# Altium project Dionysus_PCB.PrjPcb (part 2 of 2)

## Sheet Dionysus_FTDI_Comm.SchDoc: USB Communication
size B; CompanyName: Cospan Design; DrawnBy: David McCoy; Engineer: David McCoy; DocumentNumber: 8; SheetNumber: 8; SheetTotal: 8
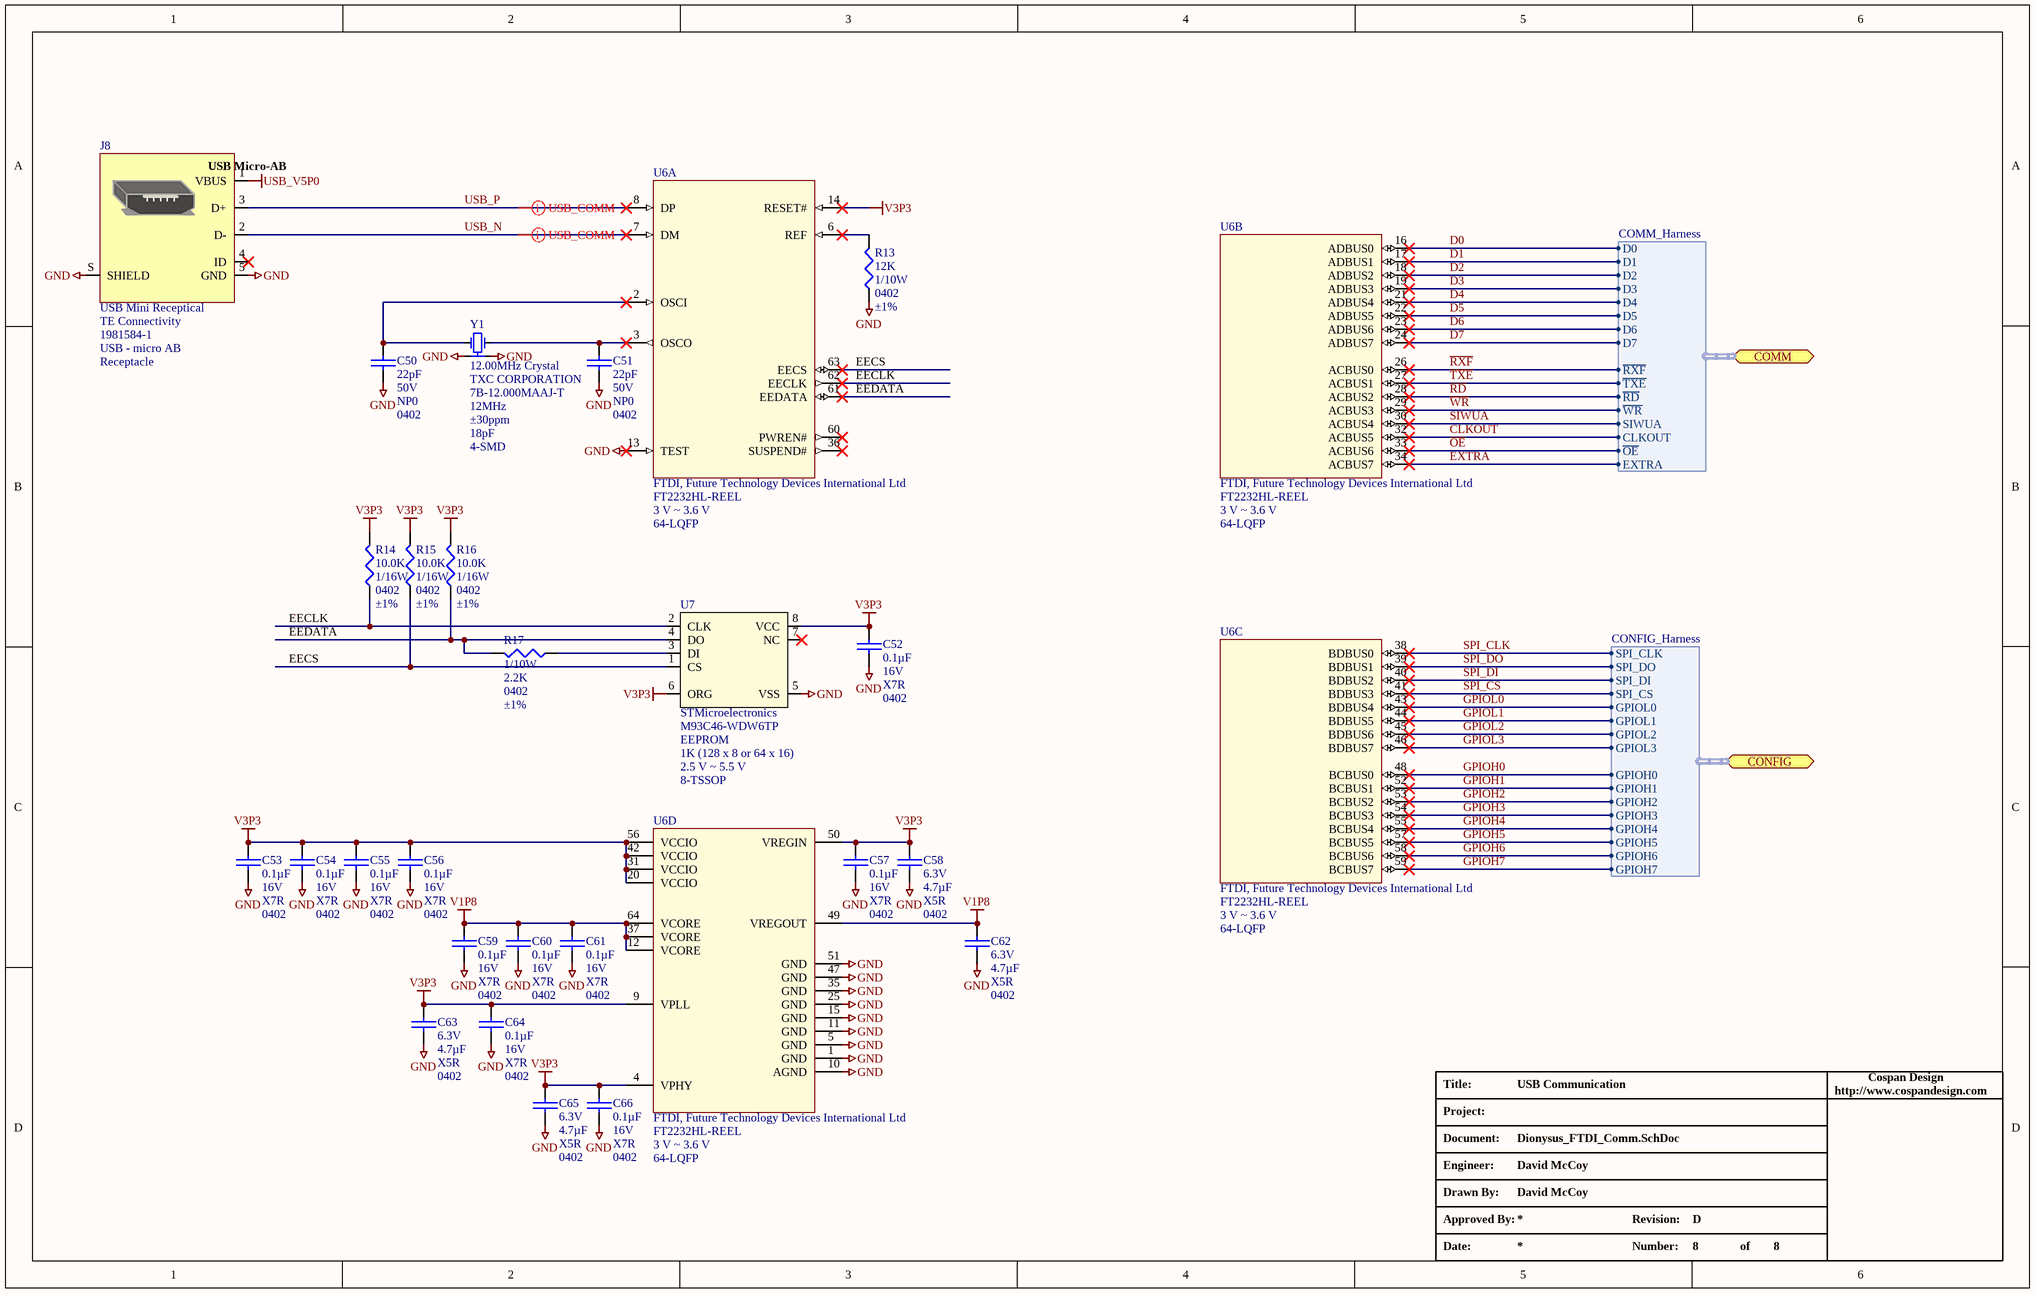
[diagram p4: Dionysus_FTDI_Comm.SchDoc]

### Parts
C50  Voltage - Rated: 50V  Temperature Coefficient: NP0  Package / Case: 0402  [C_ERA-0402]  (hidden comment: 22pF)
C51  Voltage - Rated: 50V  Temperature Coefficient: NP0  Package / Case: 0402  [C_ERA-0402]  (hidden comment: 22pF)
C52  Capacitance: 0.1µF  Voltage - Rated: 16V  Temperature Coefficient: X7R  Package / Case: 0402  [C_ERA-0402]  (hidden comment: 0.1uF)
C53  Capacitance: 0.1µF  Voltage - Rated: 16V  Temperature Coefficient: X7R  Package / Case: 0402  [C_ERA-0402]  (hidden comment: 0.1uF)
C54  Capacitance: 0.1µF  Voltage - Rated: 16V  Temperature Coefficient: X7R  Package / Case: 0402  [C_ERA-0402]  (hidden comment: 0.1uF)
C55  Capacitance: 0.1µF  Voltage - Rated: 16V  Temperature Coefficient: X7R  Package / Case: 0402  [C_ERA-0402]  (hidden comment: 0.1uF)
C56  Capacitance: 0.1µF  Voltage - Rated: 16V  Temperature Coefficient: X7R  Package / Case: 0402  [C_ERA-0402]  (hidden comment: 0.1uF)
C57  Capacitance: 0.1µF  Voltage - Rated: 16V  Temperature Coefficient: X7R  Package / Case: 0402  [C_ERA-0402]  (hidden comment: 0.1uF)
C58  Voltage - Rated: 6.3V  Capacitance: 4.7µF  Temperature Coefficient: X5R  Package / Case: 0402  [C_ERA-0402]  (hidden comment: 4.7uF)
C59  Capacitance: 0.1µF  Voltage - Rated: 16V  Temperature Coefficient: X7R  Package / Case: 0402  [C_ERA-0402]  (hidden comment: 0.1uF)
C60  Capacitance: 0.1µF  Voltage - Rated: 16V  Temperature Coefficient: X7R  Package / Case: 0402  [C_ERA-0402]  (hidden comment: 0.1uF)
C61  Capacitance: 0.1µF  Voltage - Rated: 16V  Temperature Coefficient: X7R  Package / Case: 0402  [C_ERA-0402]  (hidden comment: 0.1uF)
C62  Voltage - Rated: 6.3V  Capacitance: 4.7µF  Temperature Coefficient: X5R  Package / Case: 0402  [C_ERA-0402]  (hidden comment: 4.7uF)
C63  Voltage - Rated: 6.3V  Capacitance: 4.7µF  Temperature Coefficient: X5R  Package / Case: 0402  [C_ERA-0402]  (hidden comment: 4.7uF)
C64  Capacitance: 0.1µF  Voltage - Rated: 16V  Temperature Coefficient: X7R  Package / Case: 0402  [C_ERA-0402]  (hidden comment: 0.1uF)
C65  Voltage - Rated: 6.3V  Capacitance: 4.7µF  Temperature Coefficient: X5R  Package / Case: 0402  [C_ERA-0402]  (hidden comment: 4.7uF)
C66  Capacitance: 0.1µF  Voltage - Rated: 16V  Temperature Coefficient: X7R  Package / Case: 0402  [C_ERA-0402]  (hidden comment: 0.1uF)
J8  USB Mini Receptical  Manufacturer: TE Connectivity  Manufacturer Part Number: 1981584-1  Connector Type: USB - micro AB  Gender: Receptacle  [MICRO_USB_RECEPTICAL]
R13  Resistance (Ohms): 12K  Power (Watts): 1/10W  Case: 0402  Tolerance: ±1%  [ERA-0402]  (hidden comment: R_0402_12.0K)
R14  Resistance In Ohms: 10.0K  Power (Watts): 1/16W  Case: 0402  Tolerance: ±1%  [ERA-0402]  (hidden comment: R_0402_10.0K)
R15  Resistance In Ohms: 10.0K  Power (Watts): 1/16W  Case: 0402  Tolerance: ±1%  [ERA-0402]  (hidden comment: R_0402_10.0K)
R16  Resistance In Ohms: 10.0K  Power (Watts): 1/16W  Case: 0402  Tolerance: ±1%  [ERA-0402]  (hidden comment: R_0402_10.0K)
R17  Power (Watts): 1/10W  Resistance In Ohms: 2.2K  Case: 0402  Tolerance: ±1%  [ERA-0402]  (hidden comment: 2.2k Ohms)
U6  Manufacturer: FTDI, Future Technology Devices International Ltd  Manufacturer Part Number: FT2232HL-REEL  Voltage - Supply: 3 V ~ 3.6 V  Package / Case: 64-LQFP  [LQFP-64_N]  (hidden comment: U_FT2232H-LQFP64)  (parts A,B,C,D of 4)
U7  Manufacturer: STMicroelectronics  Manufacturer Part Number: M93C46-WDW6TP  Memory Size: 1K (128 x 8 or 64 x 16)  Voltage - Supply: 2.5 V ~ 5.5 V  Package / Case: 8-TSSOP  [TSOP65P640X120-8L]  (hidden comment: EEPROM)
Y1  12.00MHz Crystal  Manufacturer: TXC CORPORATION  Manufacturer Part Number: 7B-12.000MAAJ-T  Frequency: 12MHz  Frequency Tolerance: ±30ppm  Load Capacitance: 18pF  Package / Case: 4-SMD  [LCCS220P500X320X105-4L]

### Ports
COMM (harness COMM_Harness), CONFIG (harness CONFIG_Harness)

### Harnesses
COMM_Harness: D0, D1, D2, D3, D4, D5, D6, D7, ~{RXF}, ~{TXE}, ~{RD}, ~{WR}, SIWUA, CLKOUT, ~{OE}, EXTRA
CONFIG_Harness: SPI_CLK, SPI_DO, SPI_DI, SPI_CS, GPIOL0, GPIOL1, GPIOL2, GPIOL3, GPIOH0, GPIOH1, GPIOH2, GPIOH3, GPIOH4, GPIOH5, GPIOH6, GPIOH7

### Nets
GND: C50.1 C51.1 C52.1 C53.1 C54.1 C55.1 C56.1 C57.1 C58.1 C59.1 C60.1 C61.1 C62.1 C63.1 C64.1 C65.1 C66.1 J8.5(GND) J8.S(SHIELD) R13.2 U6.1(GND) U6.5(GND) U6.10(AGND) U6.11(GND) U6.13(TEST) U6.15(GND) U6.25(GND) U6.35(GND) U6.47(GND) U6.51(GND) U7.5(VSS) Y1.2 Y1.4
USB_V5P0: J8.1(VBUS)
V1P8: C59.2 C60.2 C61.2 C62.2 U6.12(VCORE) U6.37(VCORE) U6.49(VREGOUT) U6.64(VCORE)
V3P3: C52.2 C53.2 C54.2 C55.2 C56.2 C57.2 C58.2 C63.2 C64.2 C65.2 C66.2 R14.1 R15.1 R16.1 U6.4(VPHY) U6.9(VPLL) U6.14(RESET#) U6.20(VCCIO) U6.31(VCCIO) U6.42(VCCIO) U6.50(VREGIN) U6.56(VCCIO) U7.6(ORG) U7.8(VCC)
CLKOUT: U6.32(ACBUS5) ; port COMM.CLKOUT
D0: U6.16(ADBUS0) ; port COMM.D0
D1: U6.17(ADBUS1) ; port COMM.D1
D2: U6.18(ADBUS2) ; port COMM.D2
D3: U6.19(ADBUS3) ; port COMM.D3
D4: U6.21(ADBUS4) ; port COMM.D4
D5: U6.22(ADBUS5) ; port COMM.D5
D6: U6.23(ADBUS6) ; port COMM.D6
D7: U6.24(ADBUS7) ; port COMM.D7
EECLK: R14.2 U6.62(EECLK) U7.2(CLK)
EECS: R15.2 U6.63(EECS) U7.1(CS)
EEDATA: R16.2 R17.1 U6.61(EEDATA) U7.4(DO)
EXTRA: U6.34(ACBUS7) ; port COMM.EXTRA
GPIOH0: U6.48(BCBUS0) ; port CONFIG.GPIOH0
GPIOH1: U6.52(BCBUS1) ; port CONFIG.GPIOH1
GPIOH2: U6.53(BCBUS2) ; port CONFIG.GPIOH2
GPIOH3: U6.54(BCBUS3) ; port CONFIG.GPIOH3
GPIOH4: U6.55(BCBUS4) ; port CONFIG.GPIOH4
GPIOH5: U6.57(BCBUS5) ; port CONFIG.GPIOH5
GPIOH6: U6.58(BCBUS6) ; port CONFIG.GPIOH6
GPIOH7: U6.59(BCBUS7) ; port CONFIG.GPIOH7
GPIOL0: U6.43(BDBUS4) ; port CONFIG.GPIOL0  [project net FPGA_PROGRAM]
GPIOL1: U6.44(BDBUS5) ; port CONFIG.GPIOL1
GPIOL2: U6.45(BDBUS6) ; port CONFIG.GPIOL2
GPIOL3: U6.46(BDBUS7) ; port CONFIG.GPIOL3
~{OE}: U6.33(ACBUS6) ; port COMM.~{OE}
~{RD}: U6.28(ACBUS2) ; port COMM.~{RD}
~{RXF}: U6.26(ACBUS0) ; port COMM.~{RXF}
SIWUA: U6.30(ACBUS4) ; port COMM.SIWUA
SPI_CLK: U6.38(BDBUS0) ; port CONFIG.SPI_CLK
SPI_CS: U6.41(BDBUS3) ; port CONFIG.SPI_CS
SPI_DI: U6.40(BDBUS2) ; port CONFIG.SPI_DI
SPI_DO: U6.39(BDBUS1) ; port CONFIG.SPI_DO
~{TXE}: U6.27(ACBUS1) ; port COMM.~{TXE}
USB_N: J8.2(D-) U6.7(DM)
USB_P: J8.3(D+) U6.8(DP)
~{WR}: U6.29(ACBUS3) ; port COMM.~{WR}
NetC50_2: C50.2 U6.2(OSCI) Y1.1
NetC51_2: C51.2 U6.3(OSCO) Y1.3
NetR13_1: R13.1 U6.6(REF)
NetR17_2: R17.2 U7.3(DI)

Not connected (* = marked no-connect by the designer): J8 4(ID)*; U6 36(SUSPEND#)* 60(PWREN#)*; U7 7(NC)*

### Layout directives
differential pair: USB_N, USB_P

### Notes on the sheet
- Title:
- http://www.cospandesign.com
- Cospan Design
- Project:
- Document:
- Engineer:
- Drawn By:
- Approved By:
- Revision:
- Date:
- Number:
- of
- (in symbol J_USB_MICRO_AB) USB Micro-AB

### Library data of the parts
C50 C51 = C_0402_22PF_50V: CAP CER 22PF 50V NP0 0402; Manufacturer: TDK Corporation; Manufacturer Part Number: C1005C0G1H220F; Description: CAP CER 22PF 50V 1% NP0 0402; Tolerance: ±1%; Supplier 1: Digi-Key; Supplier Part Number 1: 445-5360-1-ND; RoHS: RoHS Compliant; Category: Capacitors; Stock 1: 16726; Pricing: 1=0.44, 10=0.385, 100=0.1925, 250=0.154, 500=0.14026, 1000=0.1265, 5000=0.1045 (USD); Mounting Type: Surface Mount, MLCC; Operating Temperature: -55°C ~ 125°C; Features: -; Applications: General Purpose; Ratings: -; Size / Dimension: 0.039" L x 0.020" W (1.00mm x 0.50mm); Lead Spacing: -; Packaging: Cut Tape (CT); Lead Style: -; ComponentLink1URL: http://www.tdk.com/pdf/tight_tol_B11.pdf; ComponentLink1Description: http://www.tdk.com/pdf/tight_tol_B11.pdf; Capacitance: 22pF; Height - Seated (Max): -; Thickness (Max): 0.022" (0.55mm)
C52-C57 C59-C61 C64 C66 = C_0402_0.1UF_16V: CAP CER .10UF 16V X7R 0402; Manufacturer: TDK Corporation; Manufacturer Part Number: C1005X7R1C104K; Tolerance: ±10%; Supplier 1: Digi-Key; Supplier Part Number 1: 445-4952-1-ND; RoHS: RoHS Compliant; Category: Capacitors; Stock 1: 230800; Pricing: 10=0.024, 100=0.0143, 500=0.00826, 1000=0.00572 (USD); Mounting Type: Surface Mount, MLCC; Features: General Purpose; Lead Spacing: -; Thickness: 0.50mm; Packaging: Cut Tape (CT); ComponentLink1URL: http://www.tdk.co.jp/tefe02/e412_c.pdf; ComponentLink1Description: http://www.tdk.co.jp/tefe02/e412_c.pdf; Operating Temperature: -55°C ~ 125°C
C58 C62 C63 C65 = C_0402_4.7UF: CAP CER 4.7UF 6.3V X5R 0402; Manufacturer: Murata Electronics North America; Manufacturer Part Number: GRM155R60J475ME87D; Tolerance: ±20%; Supplier 1: Digi-Key; Supplier Part Number 1: 445-7395-1-ND; RoHS: RoHS Compliant; Category: Capacitors; Stock 1: 1176918; Pricing: 1=0.46, 10=0.365, 50=0.264, 100=0.22, 250=0.165, 500=0.1408, 1000=0.11, 5000=0.0836 (USD); Mounting Type: Surface Mount, MLCC; Operating Temperature: -55°C ~ 85°C; Applications: General Purpose; Ratings: -; Size / Dimension: 0.039" L x 0.020" W (1.00mm x 0.50mm); Height: -; Thickness: 0.022" (0.55mm); Lead Spacing: -; Features: -; Packaging: Cut Tape (CT); Lead Style: -; ComponentLink1URL: http://www.murata.com/products/catalog/pdf/c02e.pdf; ComponentLink1Description: http://www.murata.com/products/catalog/pdf/c02e.pdf; Stock 2: 8098; Pricing 2: 1=0.32, 10=0.28, 100=0.14, 250=0.112, 500=0.102, 1000=0.092, 5000=0.076 (USD); Height - Seated (Max): -; Thickness (Max): 0.026" (0.65mm); ComponentLink2URL: http://www.tdk.com/pdf/general_B11.pdf; ComponentLink2Description: http://www.tdk.com/pdf/general_B11.pdf
J8 = J_USB_MICRO_AB: CONN RCPT MICRO USB TYPE AB; Number of Contacts: 5; Specifications: USB 1.0; Supplier 1: Digi-Key; Supplier Part Number 1: A97799CT-ND; RoHS: RoHS Compliant; Category: Connectors, Interconnects; Stock 1: 8650; Pricing: 1=1.23, 10=1.082, 25=1.0184, 50=0.9758, 100=0.9334, 250=0.84856, 500=0.76368 (USD); Mounting Type: Surface Mount, Right Angle, Horizontal; Features: -; Packaging: Cut Tape (CT); Ingress Protection: -; ComponentLink1URL: http://documents.tycoelectronics.com/commerce/DocumentDelivery/DDEController?Action=srchrtrv&DocNm=1981584&DocType=CD&DocLang=EN; ComponentLink1Description: http://documents.tycoelectronics.com/commerce/DocumentDelivery/DDEController?Action=srchrtrv&DocNm=1981584&DocType=CD&DocLang=EN
R13 = R_0402_12.0K: RES 12.0K OHM 1/16W 1% 0402 SMD; Manufacturer: Panasonic - ECG; Manufacturer Part Number: ERJ-2RKF1202X; Description: RES 12.0K OHM 1/10W 1% 0402 SMD; Temperature Coefficient: ±100ppm/°C; Supplier 1: Digi-Key; Supplier Part Number 1: P12.0KLDKR-ND; RoHS: RoHS Compliant; Category: Resistors; Stock 1: 282752; Pricing: 1=0.06, 50=0.0242, 100=0.0184, 250=0.01364, 500=0.01008, 1000=0.00672, 5000=0.00473 (USD); Composition: Thick Film; Features: -; Size / Dimension: 0.039" L x 0.020" W (1.00mm x 0.50mm); Height: 0.014" (0.35mm); Number of Terminations: 2; Packaging: Digi-Reel®; Package / Case: 0402 (1005 Metric); ComponentLink1URL: http://industrial.panasonic.com/www-cgi/jvcr13pz.cgi?E+PZ+3+AOA0002+ERJ2RKF1202X+7+WW; ComponentLink1Description: http://industrial.panasonic.com/www-cgi/jvcr13pz.cgi?E+PZ+3+AOA0002+ERJ2RKF1202X+7+WW
R14-R16 = R_0402_10.0K: RES 10.0K OHM 1/16W 1% 0402 SMD; Manufacturer: Stackpole Electronics Inc; Manufacturer Part Number: RMCF0402FT10K0; Description: RES 10K OHM 1/16W 1% 0402 SMD; Temperature Coefficient: ±100ppm/°C; Resistance (Ohms): 10k; Supplier 1: Digi-Key; Supplier Part Number 1: RMCF0402FT10K0CT-ND; RoHS: RoHS Compliant; Category: Resistors; Stock 1: 234525; Pricing: 1=0.04, 10=0.025, 50=0.0138, 100=0.0105, 250=0.0078, 500=0.00576, 1000=0.00384, 2500=0.00324, 5000=0.0027 (USD); Composition: Thick Film; Features: -; Packaging: Cut Tape (CT); ComponentLink1URL: http://www.seielect.com/Catalog/SEI-RMCF_RMCP.pdf; ComponentLink1Description: http://www.seielect.com/Catalog/SEI-RMCF_RMCP.pdf; Package / Case: 0402 (1005 Metric); Size / Dimension: 0.039" L x 0.020" W (1.00mm x 0.50mm); Height: 0.016" (0.40mm); Number of Terminations: 2
R17 = R_0402_2.2K: RES 2.20K OHM 1/10W 1% 0402 SMD; Manufacturer: Yageo; Manufacturer Part Number: RC0402FR-072K2L; Description: RES 2.20K OHM 1/16W 1% 0402 SMD; Temperature Coefficient: ±100ppm/°C; Supplier 1: Digi-Key; Supplier Part Number 1: 311-2.20KLRCT-ND; RoHS: RoHS Compliant; Category: Resistors; Stock 1: 0; Pricing: 10=0.014, 100=0.0063, 500=0.00382, 1000=0.0027, 5000=0.00203 (USD); Resistance (Ohms): 2.2K; Composition: Thick Film; Features: -; Size / Dimension: 0.039" L x 0.020" W (1.00mm x 0.50mm); Height: 0.016" (0.40mm); Packaging: Cut Tape (CT); Package / Case: 0402 (1005 Metric); ComponentLink1URL: http://www.yageo.com/documents/recent/PYu-RC0402_51_RoHS_L_6.pdf; ComponentLink1Description: http://www.yageo.com/documents/recent/PYu-RC0402_51_RoHS_L_6.pdf; Number of Terminations: 2
U6 = U_FT2232H-LQFP64: IC USB HS DUAL UART/FIFO 64-LQFP; Number of Channels: 2, DUART; FIFO's: 4096 Byte; Protocol: RS-232, RS-422, RS-485; With Parallel Port: Yes; Supplier 1: Digi-Key; RoHS: RoHS Compliant; Category: Integrated Circuits (ICs); Stock 1: 18803; Pricing 1: 1=6.71, 10=6.2, 50=5.77, 100=5.4, 250=4.56, 500=4.06 (USD); Features: USB to UART and/or FIFO, SPI, I2C, JTAG; With Auto Flow Control: Yes; With IrDA Encoder/Decoder: -; With False Start Bit Detection: -; With Modem Control: Yes; With CMOS: Yes; Mounting Type: Surface Mount; Supplier Device Package: 64-LQFP; Packaging: Cut Tape (CT); ComponentLink1URL: http://www.ftdichip.com/Support/Documents/DataSheets/ICs/DS_FT2232H.pdf; ComponentLink1Description: http://www.ftdichip.com/Support/Documents/DataSheets/ICs/DS_FT2232H.pdf; Supplier Part Number 1: 768-1024-1-ND
U7 = U_EEPROM_M93C46-WDW6TP: IC EEPROM 1KBIT 2MHZ 8TSSO; Description: IC EEPROM 1KBIT 2MHZ 8TSSOP; Format - Memory: EEPROMs - Serial; Interface: Microwire, 3-Wire Serial; Supplier 1: Digi-Key; RoHS: RoHS Compliant; Category: Integrated Circuits (ICs); Stock 1: 16982; Pricing 1: 1=0.64, 10=0.51, 100=0.3828, 250=0.3306, 500=0.2842, 1000=0.2204 (USD); Speed: 2MHz; Operating Temperature: -40°C ~ 85°C; Supplier Device Package: 8-TSSOP; Packaging: Cut Tape (CT); ComponentLink1URL: http://www.st.com/internet/com/TECHNICAL_RESOURCES/TECHNICAL_LITERATURE/DATASHEET/CD00001142.pdf; ComponentLink1Description: http://www.st.com/internet/com/TECHNICAL_RESOURCES/TECHNICAL_LITERATURE/DATASHEET/CD00001142.pdf; Supplier Part Number 1: 497-8655-1-ND; Memory Type: EEPROM
Y1 = Y_SMD_12.00MHZ_18PF: CRYSTAL 12.000 MHZ 18PF SMD; Operating Mode: Fundamental; Supplier 1: Digi-Key; RoHS: RoHS Compliant; Category: Crystals and Oscillators; Stock 1: 13709; Pricing 1: 1=1.13, 10=0.975, 50=0.855, 100=0.675, 500=0.57 (USD); Type: MHz Crystal; Frequency Stability: ±30ppm; Operating Temperature: -20°C ~ 70°C; Mounting Type: Surface Mount; Size / Dimension: 0.197" L x 0.126" W (5.00mm x 3.20mm); Height: 0.041" (1.05mm); Packaging: Cut Tape (CT); ComponentLink1URL: http://www.txccrystal.com/images/pdf/7b.pdf; ComponentLink1Description: http://www.txccrystal.com/images/pdf/7b.pdf; Supplier Part Number 1: 887-1099-1-ND

## Nets that join several sheets
GND: Dionysus_FPGA (53 pins), Dionysus_SDRAM (16 pins), Dionysus_Buttons_LEDs (10 pins), Dionysus_FTDI_Comm (33 pins)
V3P3: Dionysus_FPGA (49 pins), Dionysus_SDRAM (16 pins), Dionysus_Buttons_LEDs (BUTTON_0.3 BUTTON_0.4 BUTTON_1.3 BUTTON_1.4), Dionysus_FTDI_Comm (24 pins)
A0: Dionysus_FPGA (U1.35), Dionysus_SDRAM (U5.23)
A1: Dionysus_FPGA (U1.23), Dionysus_SDRAM (U5.24)
A2: Dionysus_FPGA (U1.22), Dionysus_SDRAM (U5.25)
A3: Dionysus_FPGA (U1.21), Dionysus_SDRAM (U5.26)
A4: Dionysus_FPGA (U1.14), Dionysus_SDRAM (U5.29)
A5: Dionysus_FPGA (U1.15), Dionysus_SDRAM (U5.30)
A6: Dionysus_FPGA (U1.26), Dionysus_SDRAM (U5.31)
A7: Dionysus_FPGA (U1.27), Dionysus_SDRAM (U5.32)
A8: Dionysus_FPGA (U1.29), Dionysus_SDRAM (U5.33)
A9: Dionysus_FPGA (U1.33), Dionysus_SDRAM (U5.34)
A10: Dionysus_FPGA (U1.24), Dionysus_SDRAM (U5.22)
A11: Dionysus_FPGA (U1.30), Dionysus_SDRAM (U5.35)
BA0: Dionysus_FPGA (U1.32), Dionysus_SDRAM (U5.20)
BA1: Dionysus_FPGA (U1.34), Dionysus_SDRAM (U5.21)
BUTTON0: Dionysus_FPGA (U1.60), Dionysus_Buttons_LEDs (BUTTON_1.1 C1.2 R3.2)
BUTTON1: Dionysus_FPGA (U1.138), Dionysus_Buttons_LEDs (BUTTON_0.1)
~{CAS}: Dionysus_FPGA (U1.45), Dionysus_SDRAM (U5.17)
~{CS}: Dionysus_FPGA (R8.2 U1.39), Dionysus_SDRAM (U5.19)
CKE: Dionysus_FPGA (U1.40), Dionysus_SDRAM (U5.37)
CLK: Dionysus_FPGA (U1.57), Dionysus_SDRAM (R11.2)
CLKOUT: Dionysus_FPGA (U1.123), Dionysus_FTDI_Comm (U6.32)
D0: Dionysus_FPGA (U1.133), Dionysus_FTDI_Comm (U6.16)
D1: Dionysus_FPGA (U1.132), Dionysus_FTDI_Comm (U6.17)
D2: Dionysus_FPGA (U1.131), Dionysus_FTDI_Comm (U6.18)
D3: Dionysus_FPGA (U1.127), Dionysus_FTDI_Comm (U6.19)
D4: Dionysus_FPGA (U1.119), Dionysus_FTDI_Comm (U6.21)
D5: Dionysus_FPGA (U1.116), Dionysus_FTDI_Comm (U6.22)
D6: Dionysus_FPGA (U1.118), Dionysus_FTDI_Comm (U6.23)
D7: Dionysus_FPGA (U1.115), Dionysus_FTDI_Comm (U6.24)
DQ0: Dionysus_FPGA (U1.62), Dionysus_SDRAM (U5.2)
DQ1: Dionysus_FPGA (U1.61), Dionysus_SDRAM (U5.4)
DQ2: Dionysus_FPGA (U1.59), Dionysus_SDRAM (U5.5)
DQ3: Dionysus_FPGA (U1.58), Dionysus_SDRAM (U5.7)
DQ4: Dionysus_FPGA (U1.56), Dionysus_SDRAM (U5.8)
DQ5: Dionysus_FPGA (U1.47), Dionysus_SDRAM (U5.10)
DQ6: Dionysus_FPGA (U1.139), Dionysus_SDRAM (U5.11)
DQ7: Dionysus_FPGA (U1.55), Dionysus_SDRAM (U5.13)
DQ8: Dionysus_FPGA (U1.50), Dionysus_SDRAM (U5.42)
DQ9: Dionysus_FPGA (U1.48), Dionysus_SDRAM (U5.44)
DQ10: Dionysus_FPGA (U1.75), Dionysus_SDRAM (U5.45)
DQ11: Dionysus_FPGA (U1.16), Dionysus_SDRAM (U5.47)
DQ12: Dionysus_FPGA (U1.17), Dionysus_SDRAM (U5.48)
DQ13: Dionysus_FPGA (U1.74), Dionysus_SDRAM (U5.50)
DQ14: Dionysus_FPGA (U1.66), Dionysus_SDRAM (U5.51)
DQ15: Dionysus_FPGA (U1.67), Dionysus_SDRAM (U5.53)
DQMH: Dionysus_FPGA (U1.41), Dionysus_SDRAM (U5.39)
DQML: Dionysus_FPGA (U1.43), Dionysus_SDRAM (U5.15)
FPGA_PROGRAM: Dionysus_FPGA (C74.2 R9.2 S3.1 U1.37), Dionysus_FTDI_Comm (U6.43)
GPIOL2: Dionysus_FPGA (C75.2 R26.2 S4.1 U1.111), Dionysus_FTDI_Comm (U6.45)
LED0: Dionysus_FPGA (U1.134), Dionysus_Buttons_LEDs (LED_0.1)
LED1: Dionysus_FPGA (U1.137), Dionysus_Buttons_LEDs (LED_1.1)
~{OE}: Dionysus_FPGA (U1.114), Dionysus_FTDI_Comm (U6.33)
~{RAS}: Dionysus_FPGA (U1.44), Dionysus_SDRAM (U5.18)
~{RD}: Dionysus_FPGA (U1.124), Dionysus_FTDI_Comm (U6.28)
~{RXF}: Dionysus_FPGA (U1.117), Dionysus_FTDI_Comm (U6.26)
SIWUA: Dionysus_FPGA (U1.120), Dionysus_FTDI_Comm (U6.30)
SPI_CLK: Dionysus_FPGA (U1.70), Dionysus_FTDI_Comm (U6.38)
SPI_CS: Dionysus_FPGA (U1.38), Dionysus_FTDI_Comm (U6.41)
SPI_DI: Dionysus_FPGA (U1.65), Dionysus_FTDI_Comm (U6.40)
SPI_DO: Dionysus_FPGA (U1.64), Dionysus_FTDI_Comm (U6.39)
~{TXE}: Dionysus_FPGA (U1.126), Dionysus_FTDI_Comm (U6.27)
~{WE}: Dionysus_FPGA (U1.46), Dionysus_SDRAM (U5.16)
~{WR}: Dionysus_FPGA (U1.121), Dionysus_FTDI_Comm (U6.29)